# EAGLE design mrf89-breakout (EAGLE 7.1.0)
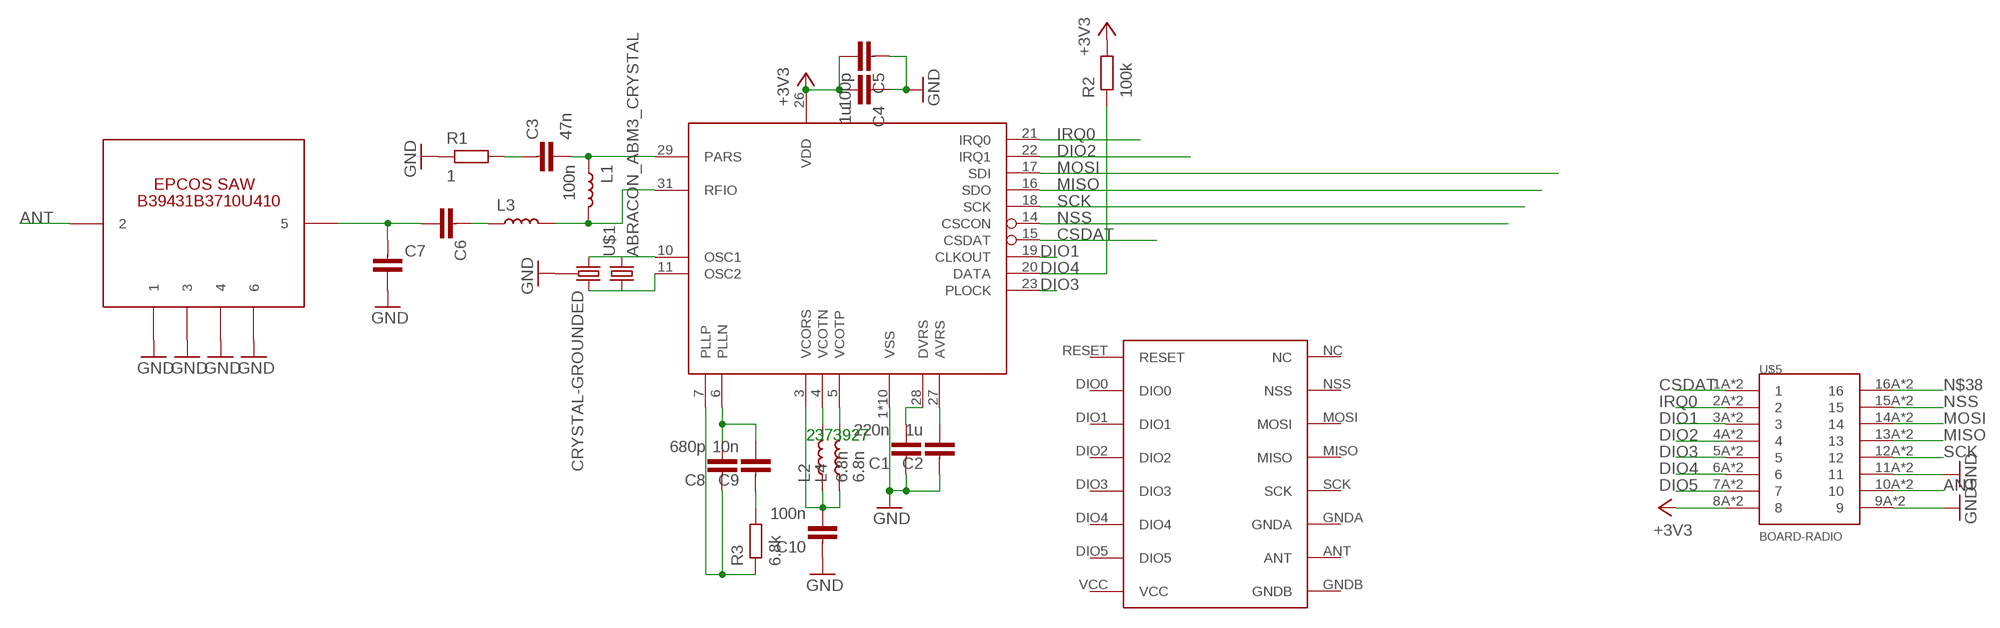
[diagram p0: schematic, sheet 1]

## Parts
C1  220n  CAPACITOR0603-N  [C0603-N]
C2  1u  CAPACITOR0603-N  [C0603-N]
C3  47n  CAPACITOR0603-N  [C0603-N]
C4  1u  CAPACITOR0603-N  [C0603-N]
C5  100p  CAPACITOR0603-N  [C0603-N]
C6  CAPACITOR0603-N  [C0603-N]
C7  CAPACITOR0603-N  [C0603-N]
C8  680p  CAPACITOR0603-N  [C0603-N]
C9  10n  CAPACITOR0603-N  [C0603-N]
C10  100n  CAPACITOR0603-N  [C0603-N]
IC1  MRF89XA  [QFN32]
L1  100n  INDUCTOR0603-N  [L0603-N]
L2  6.8n  INDUCTOR0402-N  [L0402-N]
L3  INDUCTOR0402-N  [L0402-N]
L4  6.8n  INDUCTOR0402-N  [L0402-N]
R1  1  RESISTOR0603-N  [R0603-N]
R2  100k  RESISTOR0603-N  [R0603-N]
R3  6.8k  RESISTOR0603-N  [R0603-N]
U$1  ABRACON_ABM3_CRYSTAL  [ABRACON_ABM3_CRYSTAL]
U$2  EPCOS_SAW_FILTER  [EPCOS_SAW_FILTER]
U$3  RFM69HW  [RFM]
U$4  CRYSTAL-GROUNDED  [CRYSTAL-SMD-5X3]
U$5  BOARD-RADIO  [BOARD-RADIO]

## Nets
+3V3: C4.2 C5.2 IC1.26(VDD) R2.2 U$5.8A U$5.8B
ANT: U$2.P$2 U$5.10A U$5.10B
CSDAT: IC1.15(CSDAT) U$5.1A U$5.1B
DIO1: IC1.19(CLKOUT) U$5.3A U$5.3B
DIO2: IC1.22(IRQ1) U$5.4A U$5.4B
DIO3: IC1.23(PLOCK) U$5.5A U$5.5B
DIO4: IC1.20(DATA) R2.1 U$5.6A U$5.6B
DIO5: U$5.7A U$5.7B
GND: C1.1 C2.1 C4.1 C5.1 C7.2 C10.1 IC1.1(VSS) IC1.2(VSS) IC1.8(VSS) IC1.9(VSS) IC1.12(VSS) IC1.24(VSS) IC1.25(VSS) IC1.30(VSS) IC1.32(VSS) IC1.EXP(VSS) R1.1 U$2.P$1 U$2.P$3 U$2.P$4 U$2.P$6 U$4.2 U$4.4 U$5.9A U$5.9B U$5.11A U$5.11B
IRQ0: IC1.21(IRQ0) U$5.2A U$5.2B
MISO: IC1.16(SDO) U$5.13A U$5.13B
MOSI: IC1.17(SDI) U$5.14A U$5.14B
N$1: C1.2 IC1.28(DVRS)
N$2: C2.2 IC1.27(AVRS)
N$3: C3.2 IC1.29(PARS) L1.1
N$4: IC1.31(RFIO) L1.2 L3.2
N$5: C6.1 L3.1
N$6: C6.2 C7.1 U$2.P$5
N$7: C8.1 IC1.7(PLLP) R3.1
N$8: C8.2 C9.2 IC1.6(PLLN)
N$9: C9.1 R3.2
N$10: IC1.4(VCOTN) L2.2
N$11: IC1.5(VCOTP) L4.2
N$12: C10.2 IC1.3(VCORS) L2.1 L4.1
N$14: C3.1 R1.2
N$16: IC1.10(OSC1) U$1.P$2 U$4.3
N$17: IC1.11(OSC2) U$1.P$1 U$4.1
N$38: U$5.16A U$5.16B
NSS: IC1.14(CSCON) U$5.15A U$5.15B
SCK: IC1.18(SCK) U$5.12A U$5.12B
Unconnected: U$3.ANT U$3.DIO0 U$3.DIO1 U$3.DIO2 U$3.DIO3 U$3.DIO4 U$3.DIO5 U$3.GNDA U$3.GNDB U$3.MISO U$3.MOSI U$3.NC U$3.NSS U$3.RESET U$3.SCK U$3.VCC

## Notes on the sheet
- 2373927

## Library data of the parts
C1-C10 = passives-7351:CAPACITOR
IC1 = Mine:MRF89XA
L1-L4 = passives-7351:INDUCTOR
R1-R3 = passives-7351:RESISTOR
U$1 = Ava:ABRACON_ABM3_CRYSTAL
U$2 = Ava:EPCOS_SAW_FILTER
U$3 = hoperf:RFM69HW
U$4 = SparkFun-FreqCtrl:CRYSTAL-GROUNDED
U$5 = Mine:BOARD-RADIO

## Board
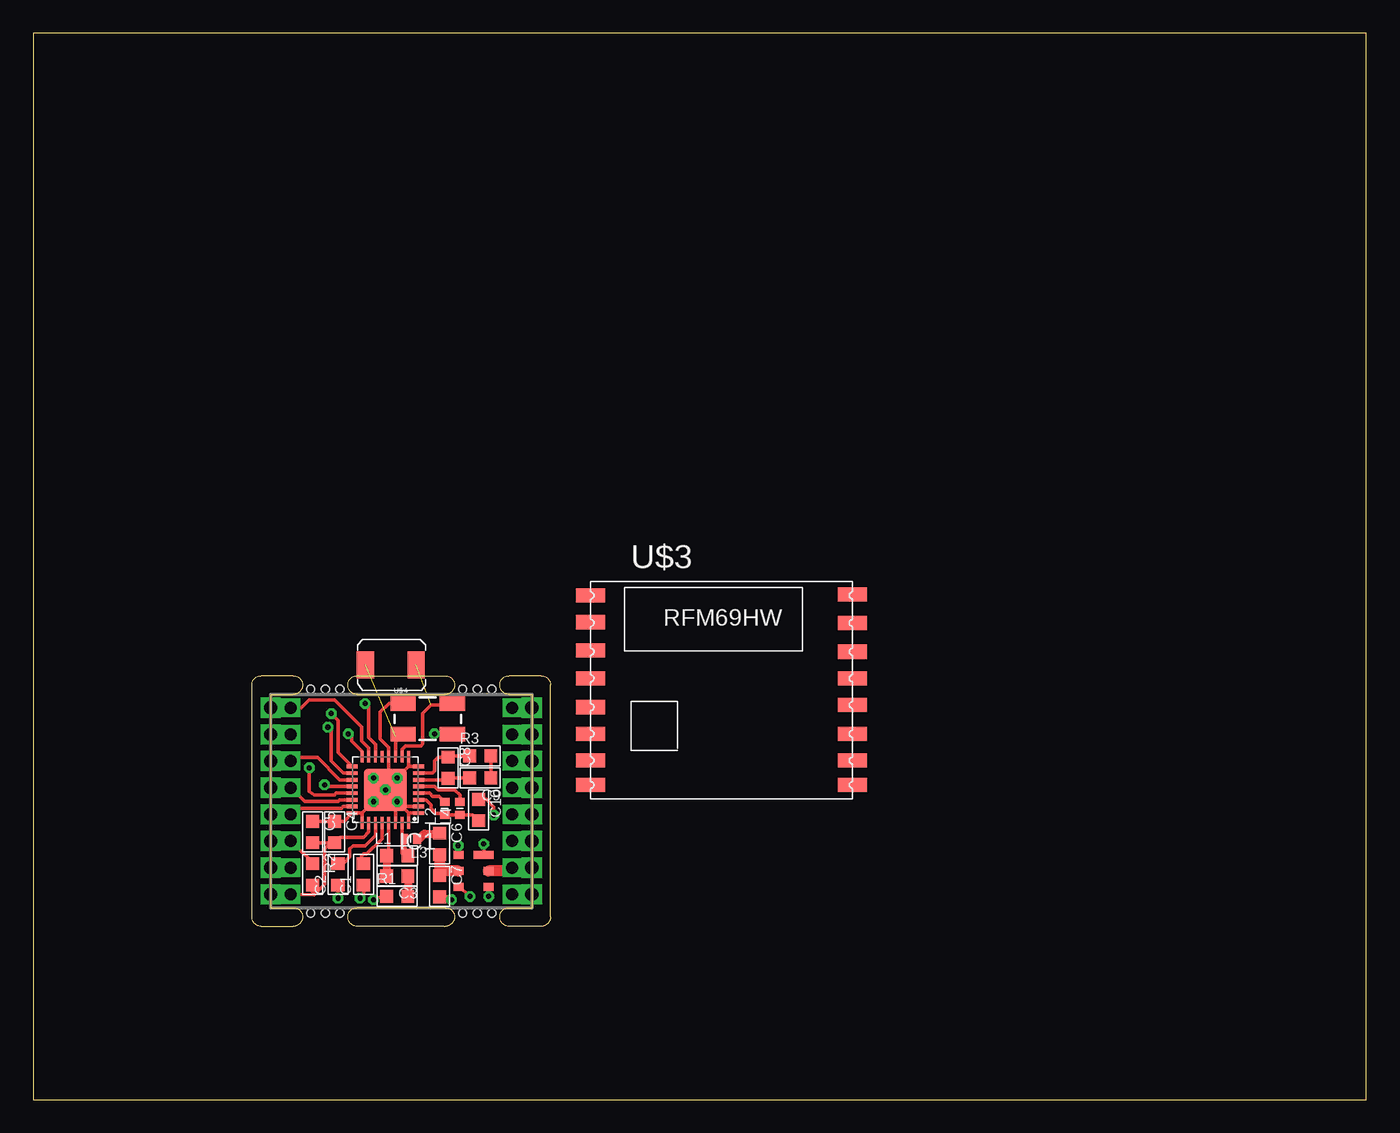
[diagram p1: board, top side]
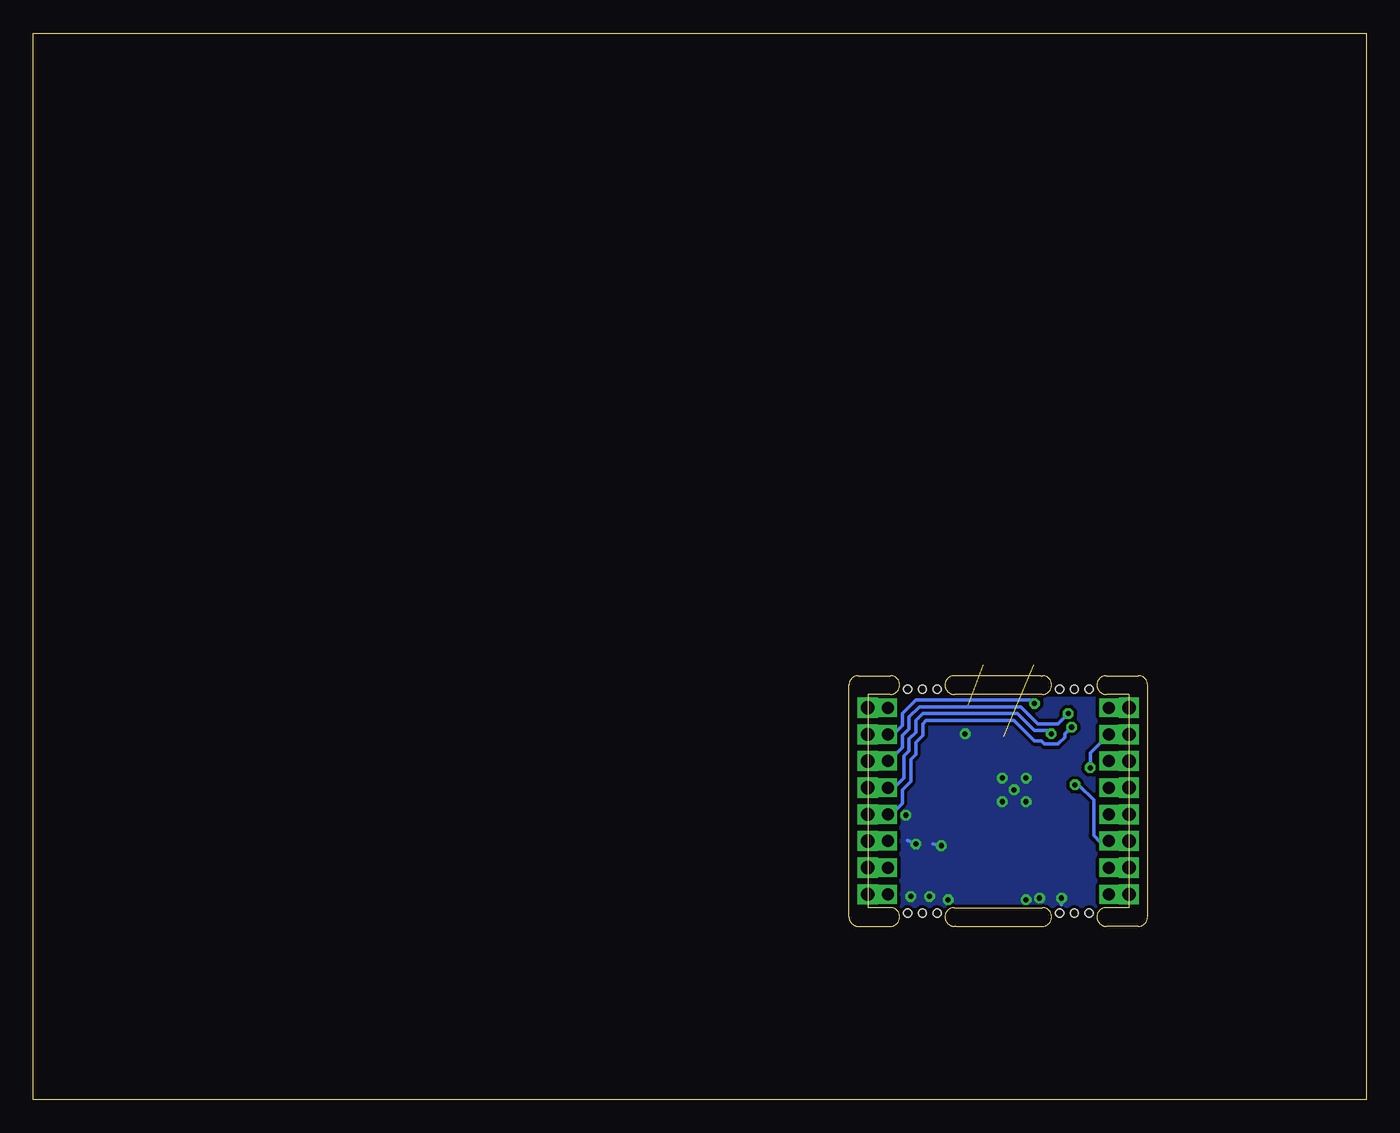
[diagram p2: board, bottom side, seen from below]

Size 100 x 80 mm. Coordinates in mm from the lower left corner, seen from the top.
Outline: 0,0 100,0 100,80 0,80 0,0
Copper layers (1*16): Top 0.035mm / dielectric 1.5mm / Bottom 0.035mm
Design rules "default *": minimum track width 10mil, minimum drill 12mil, track to track 8mil, track to pad 8mil, pad to pad 7mil, via to via 8mil, smd to smd 0mil, copper to edge 10mil, drill to drill 8mil, minimum pad ring 10mil, minimum via ring 8mil, stop-mask expansion 4mil, vias tented up to drill 0mil, thermal gap 10mil

### Footprints (pad centres in the part's own frame; a part is rotated, then mirrored left to right if it is on the bottom)
C0603-N = smd 0.95 x 1: 1 -0.8,0; 2 0.8,0
QFN32 = smd 0.9 x 0.3: 1 -2.489,1.75; 2 -2.489,1.25; 3 -2.489,0.75; 4 -2.489,0.25; 5 -2.489,-0.25; 6 -2.489,-0.75; 7 -2.489,-1.25; 8 -2.489,-1.75; 17 2.489,-1.75; 18 2.489,-1.25; 19 2.489,-0.75; 20 2.489,-0.25; 21 2.489,0.25; 22 2.489,0.75; 23 2.489,1.25; 24 2.489,1.75 | smd 0.3 x 0.9: 9 -1.75,-2.489; 10 -1.25,-2.489; 11 -0.75,-2.489; 12 -0.25,-2.489; 13 0.25,-2.489; 14 0.75,-2.489; 15 1.25,-2.489; 16 1.75,-2.489; 25 1.75,2.489; 26 1.25,2.489; 27 0.75,2.489; 28 0.25,2.489; 29 -0.25,2.489; 30 -0.75,2.489; 31 -1.25,2.489; 32 -1.75,2.489 | smd 3.2 x 3.2: EXP 0,0
L0603-N = smd 0.95 x 1: 1 -0.8,0; 2 0.8,0
L0402-N = smd 0.59 x 0.72: 1 -0.48,0; 2 0.48,0
R0603-N = smd 0.95 x 1: 1 -0.8,0; 2 0.8,0
ABRACON_ABM3_CRYSTAL = smd 1.3 x 2: P$1 -3.4,0.1; P$2 0.4,0.1
EPCOS_SAW_FILTER = smd 0.6 x 1.5: P$1 -1.2,0.75 | smd 0.6 x 0.75: P$2 0,1.125; P$3 1.2,1.125; P$4 1.2,-1.125; P$5 0,-1.125; P$6 -1.2,-1.125
RFM = smd 2.184 x 1.067: ANT 19.651,2.889; DIO0 0,13.27; DIO1 0,11.143; DIO2 0,9.047; DIO3 0,6.889; DIO4 0,4.889; DIO5 0,2.889; GNDA 19.651,4.889; GNDB 19.651,1.048; MISO 19.651,9.047; MOSI 19.651,11.047; NC 19.651,15.334; NSS 19.651,13.206; RESET 0,15.27; SCK 19.651,7.048; VCC 0,1.048
CRYSTAL-SMD-5X3 = smd 1.9 x 1.1: 1 -1.85,-1.15; 2 1.85,-1.15; 3 1.85,1.15; 4 -1.85,1.15
BOARD-RADIO = drill 1 pad 1.016 square: 1A 0,14; 2A 0,12; 3A 0,10; 4A 0,8; 5A 0,6; 6A 0,4; 7A 0,2; 8A 0,0; 9A 19.6,0; 10A 19.6,2; 11A 19.6,4; 12A 19.6,6; 13A 19.6,8; 14A 19.6,10; 15A 19.6,12; 16A 19.6,14 | drill 0.9 pad 1.016 square: 1B 1.5,14; 2B 1.5,12; 3B 1.5,10; 4B 1.5,8; 5B 1.5,6; 6B 1.5,4; 7B 1.5,2; 8B 1.5,0; 9B 18.1,0; 10B 18.1,2; 11B 18.1,4; 12B 18.1,6; 13B 18.1,8; 14B 18.1,10; 15B 18.1,12; 16B 18.1,14
BOARD-RADIO-CUTOUT = hole 0.6: 3,16.4; 4.1,16.4; 5.2,16.4; 16.6,16.4; 15.5,16.4; 14.4,16.4; 16.6,-0.4; 15.5,-0.4; 14.4,-0.4; 3,-0.4; 4.1,-0.4; 5.2,-0.4

### Placement (x,y rotation side)
C1  24.77,16.89 90 top
C2  22.86,16.89 90 top
C3  27.3,16.76 180 top
C4  22.61,20.07 270 top
C5  20.95,20.07 270 top
C6  30.48,19.18 270 top
C7  30.48,16 270 top
C8  31.11,24.89 270 top
C9  33.53,24.13 180 top
C10  33.4,21.72 270 top
IC1  26.42,23.24 180 top
L1  27.3,18.29 0 top
L2  30.86,21.84 90 top
L3  28.32,19.56 180 top
L4  32,21.84 90 top
R1  27.3,15.24 0 top
R2  20.95,16.89 270 top
R3  33.53,25.78 0 top
U$1  28.32,32.51 0 top
U$2  33.02,17.14 270 top
U$3  41.82,22.55 0 top
U$4  29.59,28.57 0 top
U$5  17.8,15.4 0 top
U$6  [BOARD-RADIO-CUTOUT]  17.8,14.4 0 top

### Tracks (layer width: path | path; a pad name or v marks a point on that pad's centre or on a via)
+3V3
  Top 0.254: C5.2 C4.2 | C4.2 22.06,19.01 21.84,18.8 21.84,16.13 21.34,15.62 | 21.34,15.62 20.92,15.62 R2.2 | U$5.8B 21.08,15.36 21.34,15.62 | IC1.26 25.17,20.09 24.77,19.68 23.02,19.68 C4.2
ANT
  Top 0.254: U$5.10B 35.56,17.4 35.31,17.14
  Top 0.813: 35.31,17.14 U$2.P$2
CSDAT
  Top 0.254: IC1.15 25.17,26.4 24.64,26.92 24.64,27.94 22.61,29.97 20.7,29.97 20.09,29.36 U$5.1B
DIO1
  Top 0.254: IC1.19 23,23.99 21.34,25.65 19.55,25.65 U$5.3B
DIO2
  Top 0.254: IC1.22 23,22.49 22.86,22.35 20.35,22.35 U$5.4B
DIO3
  Top 0.254: 19.58,21.74 19.43,21.59 19.56,21.59 19.59,21.11 19.59,21.12 U$5.5B 19.74,21.84 23.11,21.84 23.26,21.99 IC1.23
DIO4  (via drill 0.38)
  Top 0.254: IC1.20 22.1,23.49 v21.84,23.62 | R2.1 20.83,17.91 20.19,18.54 20.17,18.54 U$5.6B
  Bottom 0.254: U$5.6B 19.41,19.3 19.94,19.3 20.45,19.81 20.45,22.48 21.59,23.62 v21.84,23.62
GND  (via drill 0.38)
  Top 0.254: R1.1 26.16,15.24 v25.53,14.99 | C5.1 C4.1 23.3,20.87 IC1.24 24.67,21.49 | C2.1 v22.86,15.11 | C1.1 24.77,15.37 v24.51,15.11 | C7.2 31.15,15.2 v31.37,14.99 | U$4.4 26.68,29.73 26.04,29.08 26.04,27.05 26.67,26.42 26.67,25.61 | 26.67,25.61 IC1.12 | U$4.2 30.61,27.43 v30.1,27.43 | U$2.P$4 32.53,15.48 v32.77,15.24 | U$2.P$3 34.15,15.35 v34.16,15.24 | U$2.P$6 31.89,19.03 v31.88,19.05 | U$2.P$1 33.9,19.16 v33.78,19.18 | C10.1 34,22.52 34.54,21.97 v34.54,21.34 | IC1.2 27.67,21.99 | IC1.EXP v27.3,22.35 27.67,21.99 | IC1.1 28.17,21.49 | 28.17,21.49 27.67,21.99 | IC1.32 28.17,21.49 | IC1.30 27.17,22.49 IC1.EXP | IC1.25 24.67,21.49 | 24.67,21.49 IC1.EXP | 28.17,24.99 IC1.9 | IC1.8 28.17,24.99 | 26.67,25.61 26.67,23.5 IC1.EXP | 28.17,24.99 IC1.EXP
  Bottom 0.254: v25.53,14.99 25.27,14.99 | v22.86,15.11 22.86,14.61 | v24.51,15.11 24.26,14.86 | v31.37,14.99 31.5,14.99 | v32.77,15.24 32.89,15.11 | v34.16,15.24 33.91,15.24 | v31.88,19.05 32.51,19.18 | v33.78,19.18 34.42,19.43
  other vias: 26.42,23.24 27.3,24.13 25.53,24.13 25.53,22.35
  pour Bottom (isolate 0.254): 17.78,30.1 37.47,30.1 37.47,14.48 17.27,14.48 17.27,29.84
IRQ0  (via drill 0.38)
  Top 0.254: IC1.21 22.74,22.99 22.61,22.86 21.08,22.86 20.7,23.11 v20.7,24.89
  Bottom 0.254: v20.7,24.89 20.7,26.01 U$5.2B
MISO  (via drill 0.38)
  Top 0.254: IC1.16 24.67,26.13 23.88,26.92 23.88,27.18 v23.62,27.43
  Bottom 0.254: v23.62,27.43 23.88,27.69 24.89,27.69 26.16,28.96 33.27,28.96 33.78,28.45 33.78,27.56 34.29,27.05 34.29,26.16 34.67,25.78 34.67,24.13 35.44,23.36 U$5.13B
MOSI  (via drill 0.38)
  Top 0.254: v22.35,28.96 22.35,28.7 22.61,28.7 22.86,28.45 22.86,26.06 IC1.17
  Bottom 0.254: v22.35,28.96 23.11,28.19 24.64,28.19 25.91,29.46 33.53,29.46 34.29,28.7 34.29,27.81 34.8,27.3 34.8,26.42 35.85,25.36 U$5.14B
N$1
  Top 0.254: C1.2 24.64,17.44 24.64,18.29 24.77,18.41 25.02,18.41 26.17,19.56 IC1.28
N$2
  Top 0.254: IC1.27 25.67,19.82 24.89,19.05 24,19.05 23.75,18.8 23.75,18.2 23.24,17.69 C2.2
N$3
  Top 0.254: IC1.29 26.67,18.45 L1.1
  Top 0.61: L1.1 C3.2
N$4
  Top 0.254: IC1.31 27.67,18.46 L3.2 27.91,18.36 L1.2
N$5
  Top 0.61: L3.1 28.96,19.56 29.34,19.94 30.44,19.94 C6.1
N$6
  Top 0.813: U$2.P$5 30.82,17.14 C7.1 C6.2
N$7
  Top 0.254: IC1.7 29.95,24.49 30.1,24.64 30.1,25.4 30.35,25.65 31.2,25.65 C8.1 31.33,25.78 R3.1
N$8
  Top 0.254: IC1.6 30.76,23.99 C8.2 31.28,24.13 C9.2
N$9
  Top 0.254: R3.2 C9.1
N$10
  Top 0.254: IC1.4 29.71,22.99 29.97,22.73 30.45,22.73 L2.2
N$11
  Top 0.254: IC1.5 30.1,23.49 30.35,23.24 31.62,23.24 32,22.86 L4.2
N$12
  Top 0.254: C10.2 32.95,21.36 L4.1 L2.1 30.89,21.46 30.23,21.46 29.84,21.84 29.84,22.1 29.45,22.49 IC1.3
N$14
  Top 0.61: C3.1 R1.2
N$16  (1 unrouted)
  Top 0.254: IC1.10 27.67,26.27 27.94,26.54 29.08,26.54 29.21,26.67 29.21,28.96 29.84,29.59 31.18,29.59 U$4.3
N$17  (1 unrouted)
  Top 0.254: IC1.11 27.17,27.23 U$4.1
NSS  (via drill 0.38)
  Top 0.254: IC1.14 25.67,26.66 25.15,27.18 25.15,29.46 v24.89,29.72
  Bottom 0.254: v24.89,29.72 25.15,29.97 33.78,29.97 34.8,28.96 34.8,28.07 35.5,27.36 U$5.15B
SCK  (via drill 0.38)
  Top 0.254: IC1.18 23.26,24.49 22.35,25.4 22.35,27.69 v22.1,27.94
  Bottom 0.254: v22.1,27.94 22.61,27.43 22.61,27.18 23.11,26.67 24.13,26.67 24.38,26.92 24.89,26.92 26.42,28.45 33.02,28.45 33.27,28.19 33.27,27.3 33.78,26.8 33.78,25.91 34.16,25.53 34.16,23.88 34.8,23.24 34.8,22.23 35.66,21.36 U$5.12B